# Altium schematic sheet uart_key.SchDoc
size 420 x 297 mm
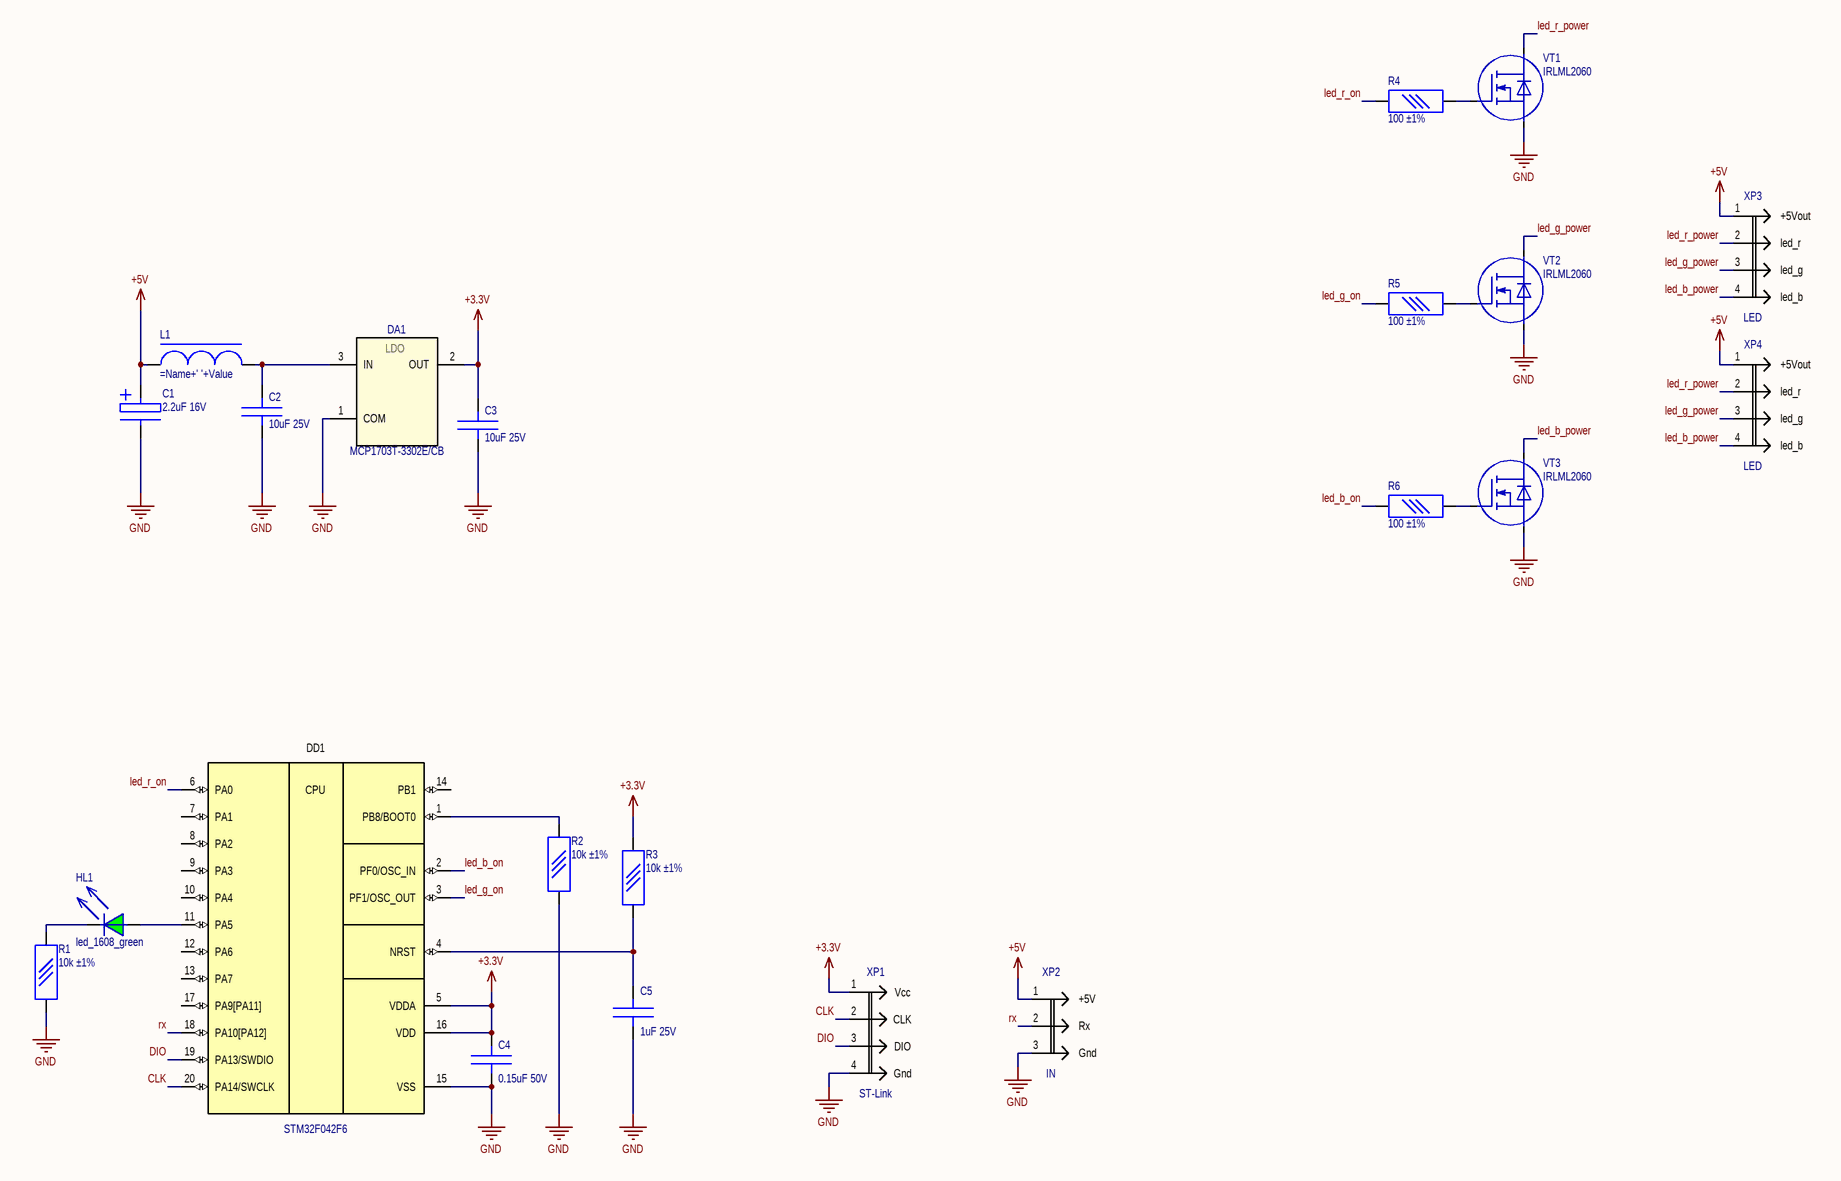
[diagram p0: uart_key.SchDoc]

## Parts
C1  2.2uF 16V  [TANT_3.2X1.6_A]
C2  10uF 25V  [CC0603_0.8mm]
C3  10uF 25V  [CC0603_0.8mm]
C4  0.15uF 50V  [CC0603_0.8mm]
C5  1uF 25V  [CC0603_0.8mm]
DA1  MCP1703T-3302E/CB  [SOT-23A_MCP]
DD1  STM32F042F6  [TSSOP-20_ST]
HL1  led_1608_green  [led_1608]
L1  (no value)  [LQH43C]
R1  10k ±1%  [R0603]
R2  10k ±1%  [R0603]
R3  10k ±1%  [R0603]
R4  100 ±1%  [R0603]
R5  100 ±1%  [R0603]
R6  100 ±1%  [R0603]
VT1  IRLML2060  [SOT-23]
VT2  IRLML2060  [SOT-23]
VT3  IRLML2060  [SOT-23]
XP1  ST-Link  Circuit_1: Vcc  Circuit_2: CLK  Circuit_3: DIO  Circuit_4: Gnd  [B4B-ZR]
XP2  IN  Circuit_1: +5V  Circuit_2: Rx  Circuit_3: Gnd  [JST_XH_B3B-XH-A_1x03_P2.50mm_Vertical]
XP3  LED  Circuit_1: +5Vout  Circuit_2: led_r  Circuit_3: led_g  Circuit_4: led_b  [JST_XH_B4B-XH-A_1x04_P2.50mm_Vertical]
XP4  LED  Circuit_1: +5Vout  Circuit_2: led_r  Circuit_3: led_g  Circuit_4: led_b  [JST_XH_B4B-XH-A_1x04_P2.50mm_Vertical]

## Nets
+3.3V: C3.1 C4.1 DA1.2(OUT) DD1.5(VDDA) DD1.16(VDD) R3.1(BOT) XP1.1
+5V: C1.2(+) L1.1 XP2.1 XP3.1 XP4.1
GND: C1.1(-) C2.2 C3.2 C4.2 C5.2 DA1.1(COM) DD1.15(VSS) R1.2(TOP) R2.1(BOT) VT1.2(S) VT2.2(S) VT3.2(S) XP1.4 XP2.3
CLK: DD1.20(PA14/SWCLK) XP1.2
DIO: DD1.19(PA13/SWDIO) XP1.3
led_b_on: DD1.2(PF0/OSC_IN) R6.1(BOT)
led_b_power: VT3.3(D) XP3.4 XP4.4
led_g_on: DD1.3(PF1/OSC_OUT) R5.1(BOT)
led_g_power: VT2.3(D) XP3.3 XP4.3
led_r_on: DD1.6(PA0) R4.1(BOT)
led_r_power: VT1.3(D) XP3.2 XP4.2
rx: DD1.18(PA10[PA12]) XP2.2
NetC2_1: C2.1 DA1.3(IN) L1.2
NetC5_1: C5.1 DD1.4(NRST) R3.2(TOP)
NetDD1_1: DD1.1(PB8/BOOT0) R2.2(TOP)
NetDD1_11: DD1.11(PA5) HL1.2(A)
NetHL1_1: HL1.1(C) R1.1(BOT)
NetR4_2: R4.2(TOP) VT1.1(G)
NetR5_2: R5.2(TOP) VT2.1(G)
NetR6_2: R6.2(TOP) VT3.1(G)

Not connected (* = marked no-connect by the designer): DD1 7(PA1) 8(PA2) 9(PA3) 10(PA4) 12(PA6) 13(PA7) 14(PB1) 17(PA9[PA11])

## Notes on the sheet
- THIS DOCUMENT AND THE DATA DISCLOSED HEREIN OR
- HEREWITH IS THE PROPERTY OF ALTIUM LIMITED AND MAY
- DWG NO:
- REVISION
- REV:
- DESCRIPTION
- DATE
- APPROVED
- BE FREELY DISTRIBUTED IN WHOLE. NO RIGHTS ARE
- RESERVED OR EXPRESS OR IMPLIED WARANTEE GIVEN.
- ENG:
- APPROVALS
- PROJECT
- DSN:
- CHK:
- REFERENCE DOCUMENTS
- PROJECT REVISION:
- TITLE
- DOCUMENT REVISION:
- DESIGN ITEM:
- BOM:
- FAB DWG:
- PCB DWG:
- ASSY DWG:
- SCALE:
- A3
- SIZE
- CAGE CODE
- FILE NAME
- DWG NO.
- SHEET
- OF
- REV
- (in symbol STM32F042F6) CPU

## Library data of the parts
C1 = Capacitor_elec: Type: Конденсатор электр.; Tolerance: ±10%; Name: Capacitor_elec; Value: 2.2uF; Voltage: 16V; Link1: https://www.chipdip.ru/product0/9000686417
C2-C5 = Capacitor: Type: Конденсатор керам.; Tolerance: ±10%; Name: Capacitor
  C2 C3: Value: 10uF; Voltage: 25V; Link1: https://www.chipdip.ru/product/grm188r61e106m
  C4: Value: 0.15uF; Voltage: 50V; Link1: https://www.chipdip.ru/product0/9000081151
  C5: Value: 1uF; Voltage: 25V; Link1: https://www.chipdip.ru/product/grm188r71e105ka12d
DA1 = MCP1703T-3302E/CB: Value: 3.3V; Name: MCP1703T-3302E/CB; Type: LDO; Link1: https://www.chipdip.ru/product/mcp1703t-3302e-cb-3
DD1 = STM32F042F6: ARM-based 32-bit MCU, up to 32 KB Flash, crystal-less USB  FS 2.0, CAN, 8 timers, ADC & comm. interfaces, 2.0 - 3.6 V; Name: STM32F042F6; Link1: *; Type: Микроконтроллер
HL1 = led_1608_green: Type: Светодиод; Name: led_1608_green; Link1: https://www.chipdip.ru/product/to-1608bc-pg
L1 = Inductor: Value: 15uH; Type: Индуктивность; Name: LQH43C; Link1: https://www.chipdip.ru/product/lqh43mn150k
R1-R3 = Res_0603: Name: R0603; Value: 10k; Link1: https://www.chipdip.ru/product0/9000079736; Tolerance: ±1%; Type: Резистор SMD
R4-R6 = Res_0603: Value: 100; Name: R0603; Link1: https://www.chipdip.ru/product0/9000079616; Tolerance: ±1%; Type: Резистор SMD
VT1-VT3 = IRLML2060: Type: MOSFET N-chanel; Name: IRLML2060; Link1: https://www.chipdip.ru/product/irlml2060trpbf
XP1 = B4B-ZR_conn_01x04_st_link: Name: B4B-ZR; Link1: https://www.chipdip.ru/product/b4b-zr; Link2: *; Link3: *; Type: Разъём
XP2 = JST_XH_B3B-XH-A_1x04_P2.50mm_Vertical_1: Name: JST_XH_B4B-XH-A_1x04_P2.50mm_Vertical; Link1: https://www.chipdip.ru/product/sct2501wv-03p-b3b-xh-a; Link2: https://www.chipdip.ru/product/sct2501h-03p-xhp-3; Link3: https://www.chipdip.ru/product/sxh-001t-0.6?from=rec_product; Type: Разъём
XP3 XP4 = JST_XH_B4B-XH-A_1x04_P2.50mm_Vertical: Name: JST_XH_B4B-XH-A_1x04_P2.50mm_Vertical; Link1: https://www.chipdip.ru/product/b4b-xh-a; Link2: https://www.chipdip.ru/product/xhp-4?from=rec_product; Link3: https://www.chipdip.ru/product/sxh-001t-0.6?from=rec_product; Type: Разъём